# Altium project PCB_Project1.PrjPCB
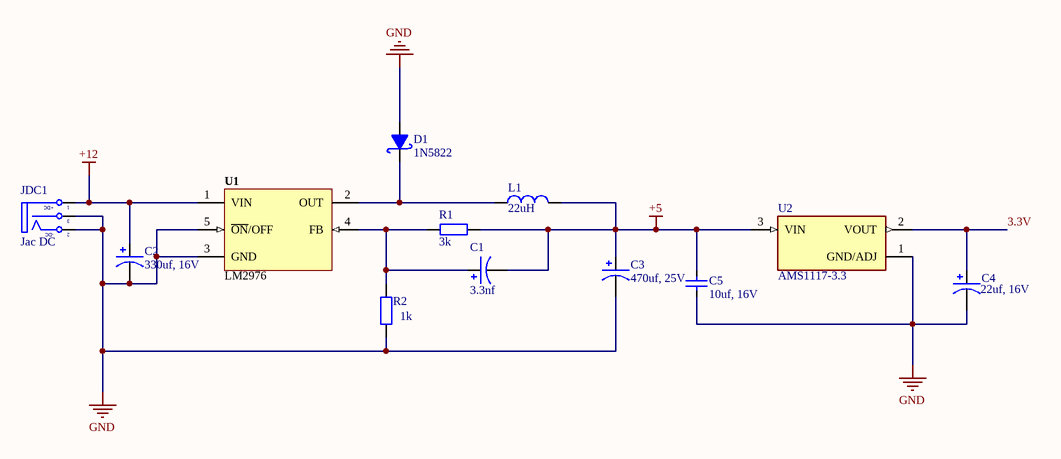
[diagram p0: Sheet1.SchDoc]
1 sheet, 12 parts. Net scope: global (net labels, ports and power ports of the same name join across sheets).
Board file: PCB1.PcbDoc

## Sheet Sheet1.SchDoc
size A4

### Parts
C1  3.3nf  [C3MM]
C2  330uf, 16V  [C8mm]
C3  470uf, 25V  [C8mm]
C4  22uf, 16V  [CA-ALU-4]
C5  10uf, 16V  [CAP_0805]
D1  1N5822  [SMA]
JDC1  Jac DC  [DC-IN]
L1  22uH  [L-SMD-M-7.3x4.5]
R1  3k  [RES-SMD-0805]
R2  1k  [RES-SMD-0805]
U1  LM2976  [TO-263]
U2  AMS1117-3.3  [SOT229P700X180-4N]

### Nets
+5: C1.2 C3.1 C5.2 L1.2 R1.1 U2.3(VIN)
+12: C2.1 JDC1.1(T) U1.1(VIN)
GND: C2.2 C3.2 C4.2 C5.1 D1.1(A) JDC1.2(TN) JDC1.3(S) R2.1 U1.3(GND) U1.5(~{ON}/OFF) U2.1(GND/ADJ)
3.3V: C4.1 U2.2(VOUT)
NetC1_1: C1.1 R1.2 R2.2 U1.4(FB)
NetD1_2: D1.2(K) L1.1 U1.2(OUT)

### Notes on the sheet
- (in symbol DCIN) +DC; -DC

### Library data of the parts
C1-C4 = Cap Pol: Polarized Capacitor (Axial); Published: 8-Jun-2000; LatestRevisionDate: 17-Jul-2002; LatestRevisionNote: Re-released for DXP Platform.; PackageReference: POLAR0.8; Publisher: Altium Limited
C5 = CapSMD: Capacitor; Value: 33p; Published: 8-Jun-2000; LatestRevisionDate: 17-Jul-2002; LatestRevisionNote: Re-released for DXP Platform.; PackageReference: RAD-0.3; Publisher: Altium Limited
D1 = 1N5822: Schottky Rectifiers; Value: Diode c?m 1N5408
JDC1 = DCIN: Jac DC input; Value: Jac DC
L1 = Inductor: Value: 150 mH
R1 R2 = Resistor - SMD: Resistor SMD; Manufacturer: Generic Components; Class: Passive; Published: 08/06/2000; Publisher: Altium Hobart Technology Centre
U1 = LM2596: Max Input Voltage: 12 V; Max Output Current: 3 (6.0 peak) A; Max Output Voltage: mV; Category: IC-Power; Min Input Voltage: mV; Min Output Voltage: mV; Mounting Technology: Surface Mount; Status: Unreleased; Supply Voltage: mV; Temperature Range: -40 to +125 degC
U2 = AMS1117-3.3: Sot223/Pkg 1-Amp 3.3-Volt Low Drop Out Voltage Regulatator; MF: Advanced Monolithic Systems; Package: SOT-223 Seeed Technology; Value: *; Check_prices: https://www.snapeda.com/parts/AMS1117-3.3/Advanced+Monolithic+Systems/view-part/?ref=eda; Price: None; Availability: Not in stock; MP: AMS1117-3.3; SnapEDA_Link: https://www.snapeda.com/parts/AMS1117-3.3/Advanced+Monolithic+Systems/view-part/?ref=snap